# Altium schematic sheet SS141_SS14.schdoc
size 127 x 101 mm
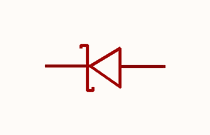
[diagram p0: SS141_SS14.schdoc]

## Parts
D?  SS14  [SMA_L4.2-W2.6-LS5.3-RD]  (value not drawn)

## Nets

Not connected (* = marked no-connect by the designer): D? 1(K) 2(A)

## Library data of the parts
D? = SS14_C2480: Manufacturer: MDD(辰达半导体); Add into BOM: yes; Diode Configuration: Independent Type; Forward Voltage (Vf@If): 550mV@1A; Reverse Voltage (Vr): 40V; Rectified Current: 1A; Reverse Leakage Current (Ir): 300uA@40V; Symbol: SS14; Device: SS14_C2480; LCSC Part Name: 电压:40V 电流:1A; Supplier Part: C2480; Manufacturer Part: SS14; Supplier Footprint: SMA(DO-214AC); JLCPCB Part Class: Basic Part; Datasheet: https://atta.szlcsc.com/upload/public/pdf/source/20240710/EF24798823EE33D63F154ED67BAC5E71.pdf; Supplier: LCSC; Convert to PCB: yes